# EAGLE design RWD 1Mb RAM Memory CPC v2_0 (EAGLE 8.6.0)
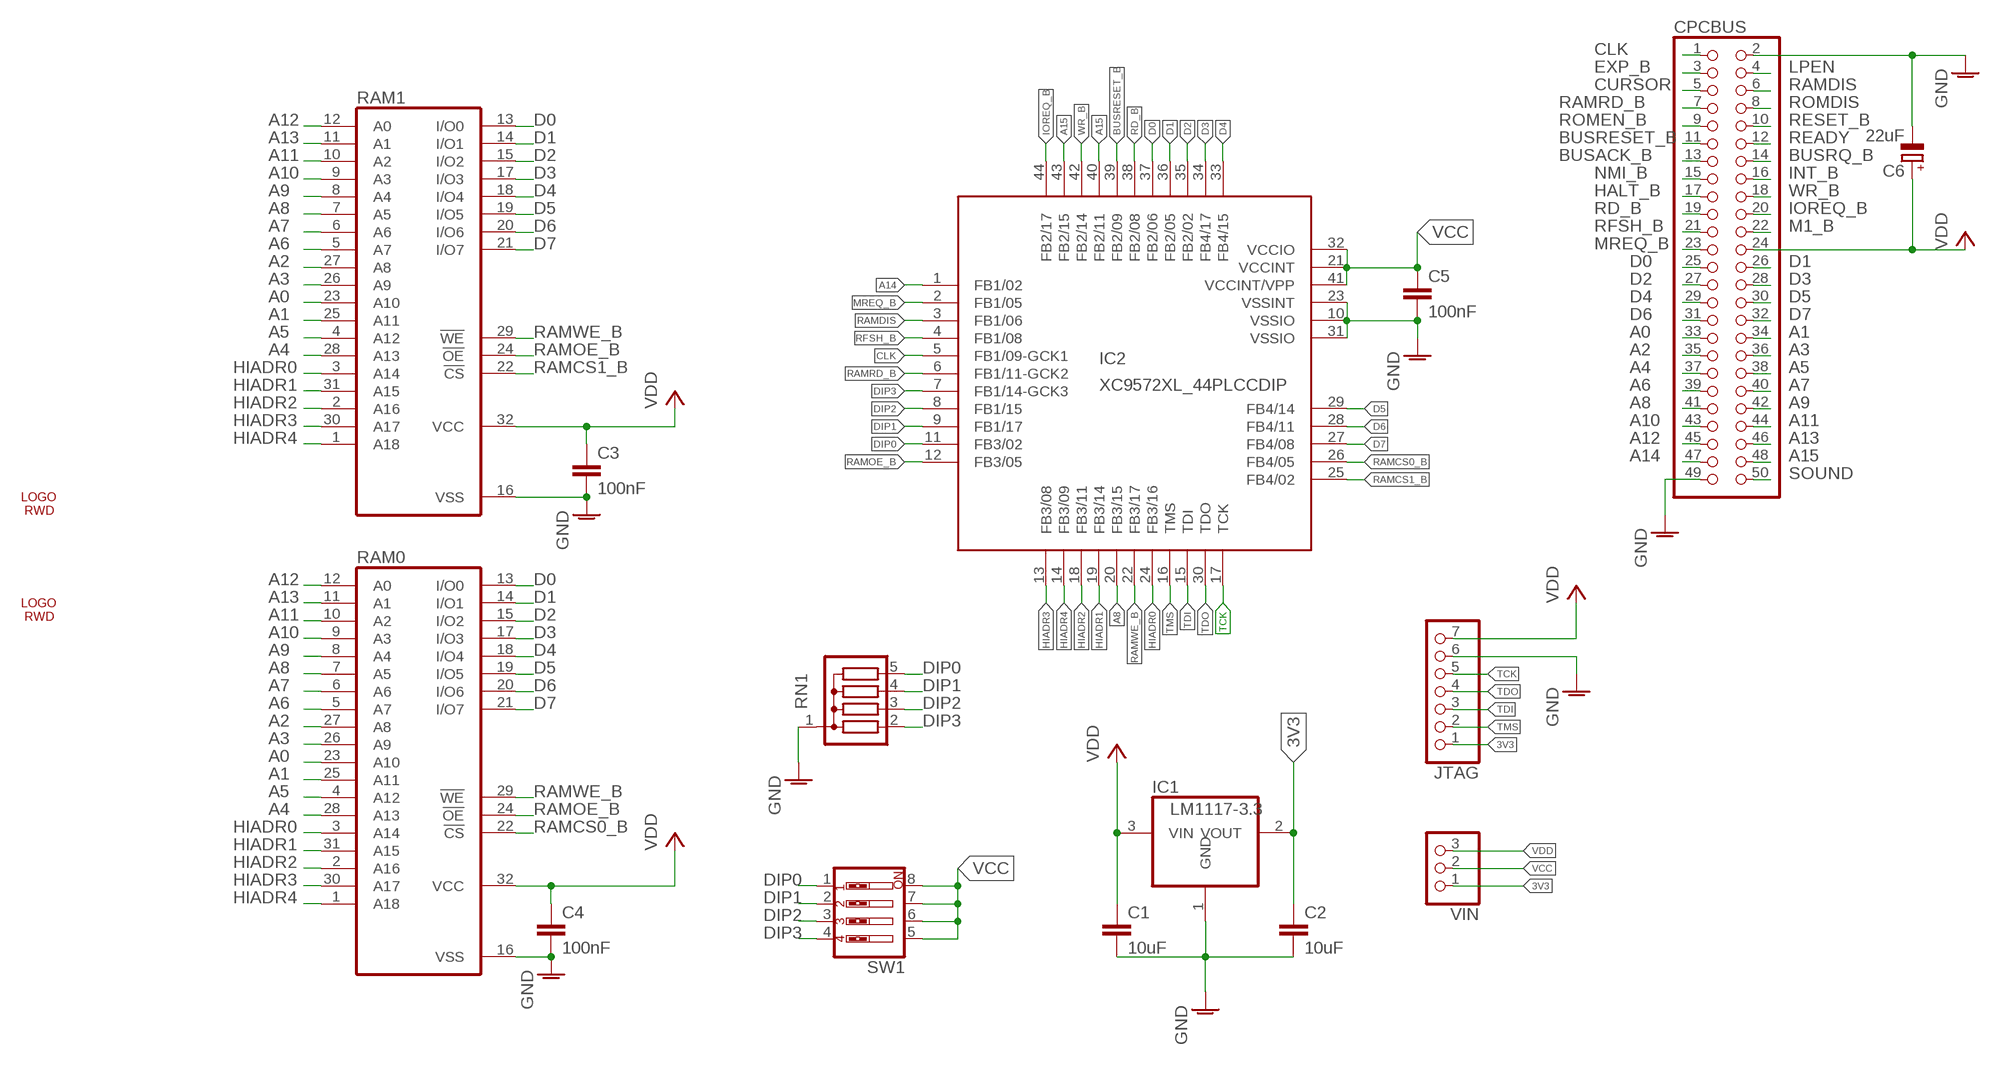
[diagram p0: schematic, sheet 1]

## Parts
C1  10uF  RCL_C-EUC0805  [RCL_C0805]
C2  10uF  RCL_C-EUC0805  [RCL_C0805]
C3  100nF  RCL_C-EUC0805  [RCL_C0805]
C4  100nF  RCL_C-EUC0805  [RCL_C0805]
C5  100nF  RCL_C-EUC0805  [RCL_C0805]
C6  22uF  CPOL-EUE2-5  [E2-5]
CPCBUS  PINHEAD_PINHD-2X25  [PINHEAD_2X25]
IC1  LM1117-3.3  BURR-BROWN_REG1117  [BURR-BROWN_SOT223]
IC2  XC9572XL_44PLCCDIP  [S44]
JTAG  PINHD-1X7  [1X07]
RAM0  MEMORY-HITACHI_628512  [MEMORY-HITACHI_DIL32]
RAM1  MEMORY-HITACHI_628512  [MEMORY-HITACHI_DIL32]
RN1  G04R  [SIL5]
SW1  SW_DIP-4  [EDG-04]
U$1  LOGO7TOP  [LOGO7_SK21]
U$2  LOGO7TOP  [LOGO7_SK21]
VIN  PINHD-1X3  [1X03]

## Nets
3V3: C2.1 IC1.2(VOUT) JTAG.1 VIN.1
A0: CPCBUS.33 RAM0.23(A10) RAM1.23(A10)
A1: CPCBUS.34 RAM0.25(A11) RAM1.25(A11)
A2: CPCBUS.35 RAM0.27(A8) RAM1.27(A8)
A3: CPCBUS.36 RAM0.26(A9) RAM1.26(A9)
A4: CPCBUS.37 RAM0.28(A13) RAM1.28(A13)
A5: CPCBUS.38 RAM0.4(A12) RAM1.4(A12)
A6: CPCBUS.39 RAM0.5(A7) RAM1.5(A7)
A7: CPCBUS.40 RAM0.6(A6) RAM1.6(A6)
A8: CPCBUS.41 IC2.20(FB3/15) RAM0.7(A5) RAM1.7(A5)
A9: CPCBUS.42 RAM0.8(A4) RAM1.8(A4)
A10: CPCBUS.43 RAM0.9(A3) RAM1.9(A3)
A11: CPCBUS.44 RAM0.10(A2) RAM1.10(A2)
A12: CPCBUS.45 RAM0.12(A0) RAM1.12(A0)
A13: CPCBUS.46 RAM0.11(A1) RAM1.11(A1)
A14: CPCBUS.47 IC2.1(FB1/02)
A15: CPCBUS.48 IC2.40(FB2/11) IC2.43(FB2/15)
AGND: C1.2 C2.2 C3.2 C4.2 C5.2 C6.- CPCBUS.2 CPCBUS.49 IC1.1(GND) IC2.10(VSSIO) IC2.23(VSSINT) IC2.31(VSSIO) JTAG.6 RAM0.16(VSS) RAM1.16(VSS) RN1.1 ; supply symbol labelled GND
BUSACK_B: CPCBUS.13
BUSRESET_B: CPCBUS.11 IC2.39(FB2/09)
BUSRQ_B: CPCBUS.14
CLK: CPCBUS.1 IC2.5(FB1/09-GCK1)
CURSOR: CPCBUS.5
D0: CPCBUS.25 IC2.37(FB2/06) RAM0.13(I/O0) RAM1.13(I/O0)
D1: CPCBUS.26 IC2.36(FB2/05) RAM0.14(I/O1) RAM1.14(I/O1)
D2: CPCBUS.27 IC2.35(FB2/02) RAM0.15(I/O2) RAM1.15(I/O2)
D3: CPCBUS.28 IC2.34(FB4/17) RAM0.17(I/O3) RAM1.17(I/O3)
D4: CPCBUS.29 IC2.33(FB4/15) RAM0.18(I/O4) RAM1.18(I/O4)
D5: CPCBUS.30 IC2.29(FB4/14) RAM0.19(I/O5) RAM1.19(I/O5)
D6: CPCBUS.31 IC2.28(FB4/11) RAM0.20(I/O6) RAM1.20(I/O6)
D7: CPCBUS.32 IC2.27(FB4/08) RAM0.21(I/O7) RAM1.21(I/O7)
DIP0: IC2.11(FB3/02) RN1.5 SW1.1
DIP1: IC2.9(FB1/17) RN1.4 SW1.2
DIP2: IC2.8(FB1/15) RN1.3 SW1.3
DIP3: IC2.7(FB1/14-GCK3) RN1.2 SW1.4
EXP_B: CPCBUS.3
HALT_B: CPCBUS.17
HIADR0: IC2.24(FB3/16) RAM0.3(A14) RAM1.3(A14)
HIADR1: IC2.19(FB3/14) RAM0.31(A15) RAM1.31(A15)
HIADR2: IC2.18(FB3/11) RAM0.2(A16) RAM1.2(A16)
HIADR3: IC2.13(FB3/08) RAM0.30(A17) RAM1.30(A17)
HIADR4: IC2.14(FB3/09) RAM0.1(A18) RAM1.1(A18)
INT_B: CPCBUS.16
IOREQ_B: CPCBUS.20 IC2.44(FB2/17)
LPEN: CPCBUS.4
M1_B: CPCBUS.22
MREQ_B: CPCBUS.23 IC2.2(FB1/05)
NMI_B: CPCBUS.15
RAMCS0_B: IC2.26(FB4/05) RAM0.22(!CS)
RAMCS1_B: IC2.25(FB4/02) RAM1.22(!CS)
RAMDIS: CPCBUS.6 IC2.3(FB1/06)
RAMOE_B: IC2.12(FB3/05) RAM0.24(!OE) RAM1.24(!OE)
RAMRD_B: CPCBUS.7 IC2.6(FB1/11-GCK2)
RAMWE_B: IC2.22(FB3/17) RAM0.29(!WE) RAM1.29(!WE)
RD_B: CPCBUS.19 IC2.38(FB2/08)
READY: CPCBUS.12
RESET_B: CPCBUS.10
RFSH_B: CPCBUS.21 IC2.4(FB1/08)
ROMDIS: CPCBUS.8
ROMEN_B: CPCBUS.9
SOUND: CPCBUS.50
TCK: IC2.17(TCK) JTAG.5
TDI: IC2.15(TDI) JTAG.3
TDO: IC2.30(TDO) JTAG.4
TMS: IC2.16(TMS) JTAG.2
VCC: C5.1 IC2.21(VCCINT) IC2.32(VCCIO) IC2.41(VCCINT/VPP) SW1.5 SW1.6 SW1.7 SW1.8 VIN.2
VDD: C1.1 C3.1 C4.1 C6.+ CPCBUS.24 IC1.3(VIN) JTAG.7 RAM0.32(VCC) RAM1.32(VCC) VIN.3
WR_B: CPCBUS.18 IC2.42(FB2/14)

## Library data of the parts
C1-C5 = Dandanator CPC MX4 v1.2 Rwd:RCL_C-EU: CAPACITOR, European symbol; SPICEPREFIX: C
C6 = rcl:CPOL-EU: POLARIZED CAPACITOR, European symbol; SPICEPREFIX: C
CPCBUS = Dandanator CPC MX4 v1.2 Rwd:PINHEAD_PINHD-2X25: PIN HEADER
IC1 = Dandanator CPC MX4 v1.2 Rwd:BURR-BROWN_REG1117: 800mA and 1A Low Dropout (LDO) Positive Regulator 1.8V, 2.5V, 2.85V, 3.3V, 5V, and Adj; MPN: REG1117; OC_FARNELL: 1097566; OC_NEWARK: 14P6981
IC2 = Dandanator CPC MX4 v1.2 Rwd:XC9572XL_44PLCC: xc9536_pc44 XC9500 In-System Programmable CPLD Family Auto generated by make-symbol-device-package-bsdl.ulp Rev. 34 Source: xc9536_pc44.bsd
JTAG = pinhead:PINHD-1X7: PIN HEADER
RAM0 RAM1 = RWD 1Mb RAM Memory CPC:MEMORY-HITACHI_628512: MEMORY; OC_FARNELL: unknown; OC_NEWARK: unknown
RN1 = resistor-sil:G04R: SIL RESISTOR; OC_FARNELL: unknown; OC_NEWARK: unknown
SW1 = special:SW_DIP-4: DIP SWITCH
U$1 U$2 = USB_Floppy_PCB_rwd:LOGO7
VIN = pinhead:PINHD-1X3: PIN HEADER

## Board
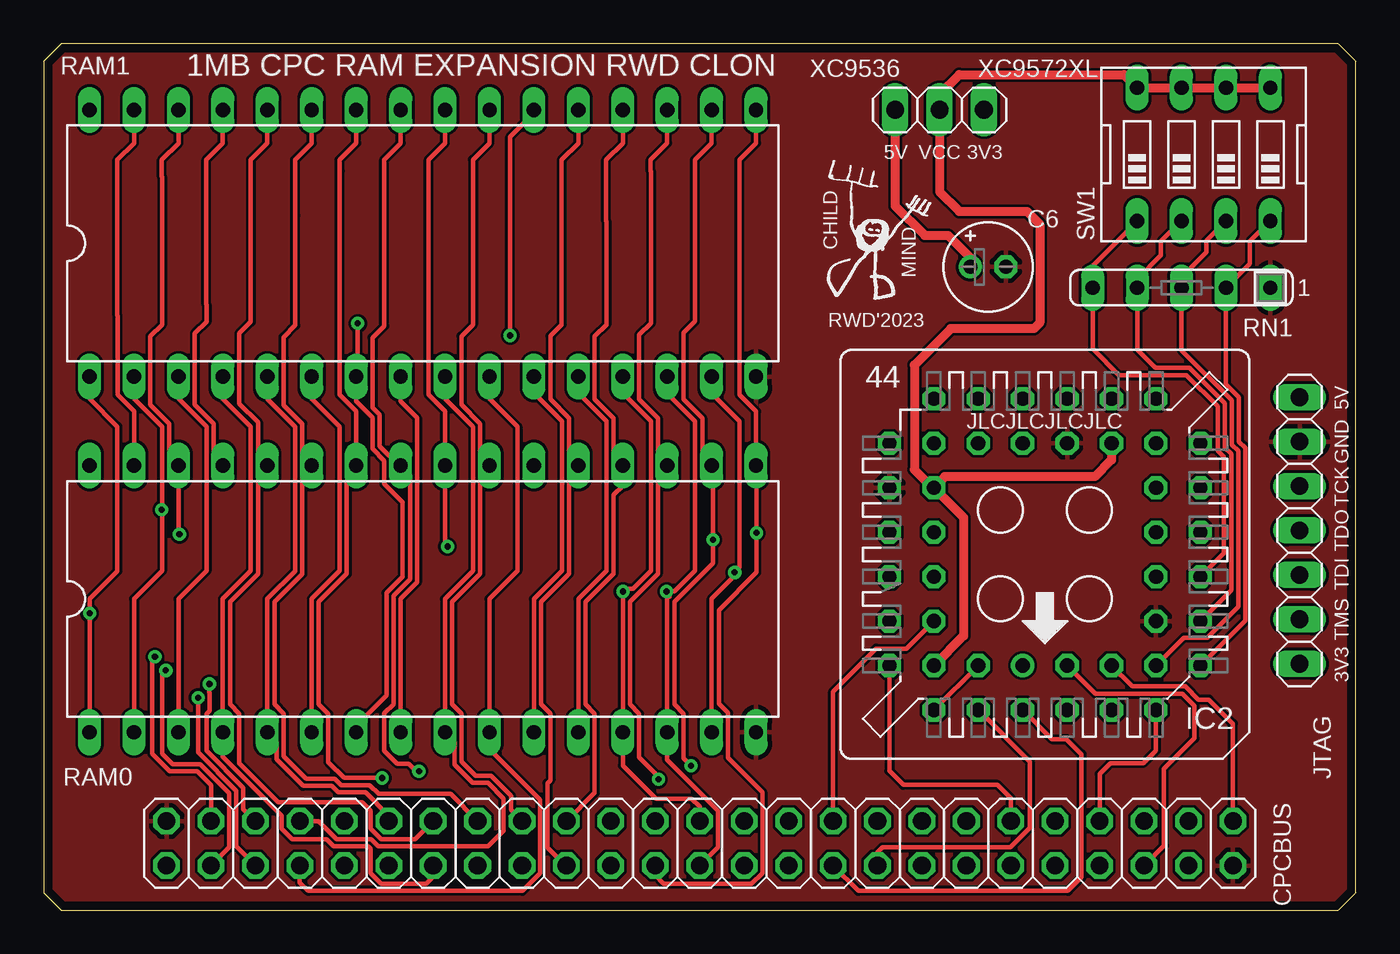
[diagram p1: board, top side]
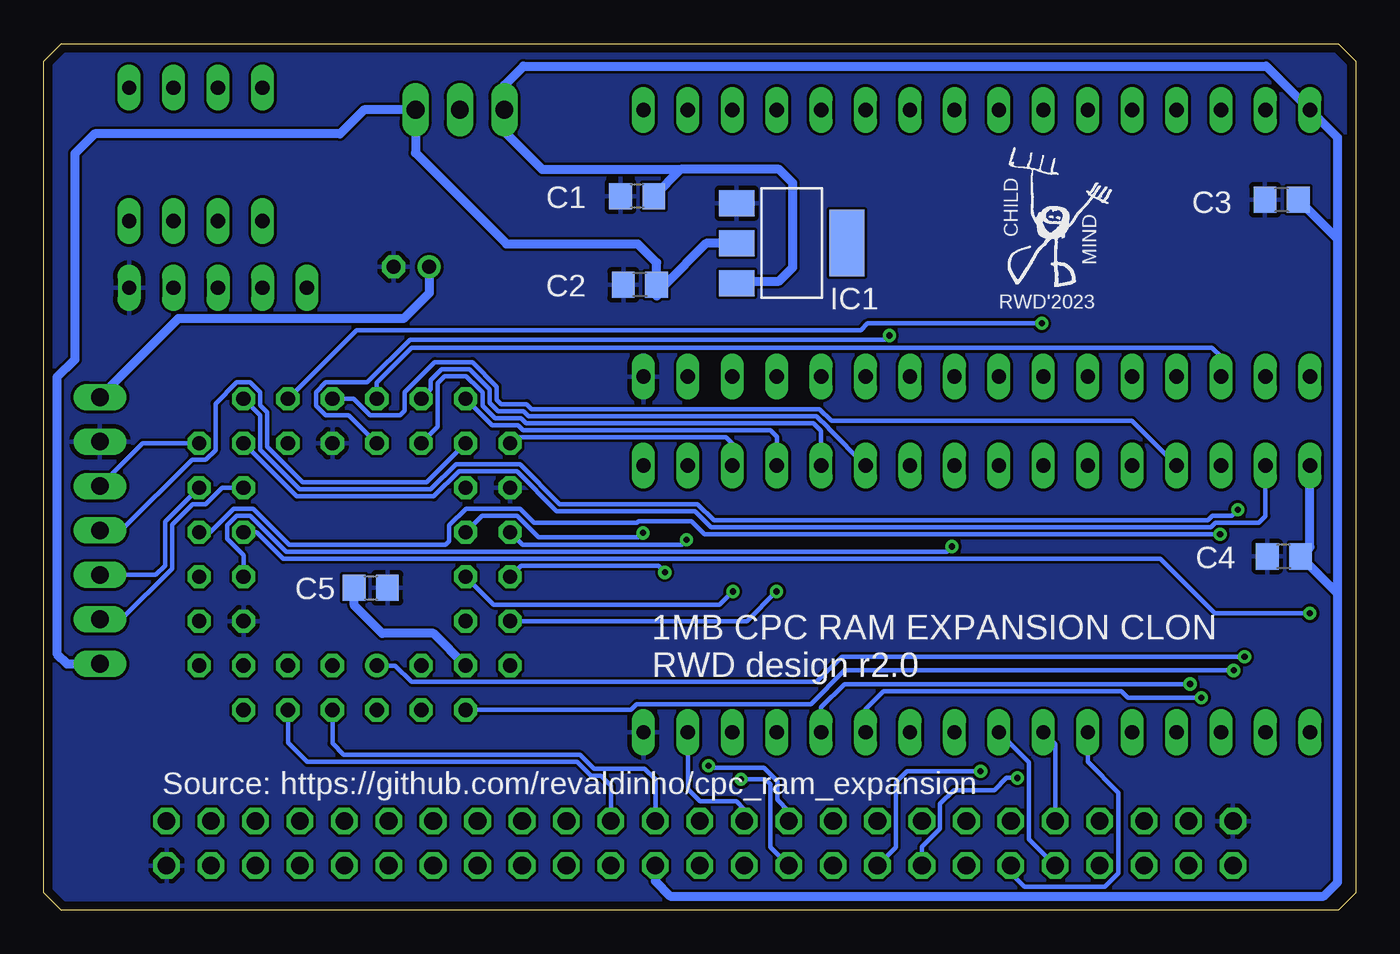
[diagram p2: board, bottom side, seen from below]

Size 75 x 49.5 mm. Coordinates in mm from the lower left corner, seen from the top.
Outline: 1,0 74,0 75,1 75,48.5 74,49.5 1,49.5 0,48.5 0,1 1,0
Copper layers (1*16): Top 0.035mm / dielectric 1.5mm / Bottom 0.035mm
Design rules "Rwd_2021": minimum track width 10mil, minimum drill 0.35mm, track to track 6mil, track to pad 6mil, pad to pad 6mil, via to via 6mil, smd to smd 6mil, copper to edge 0.5mm, drill to drill 8mil, minimum pad ring 10mil, minimum via ring 8mil, stop-mask expansion 4mil, vias tented up to drill 0mil, thermal gap 10mil

### Footprints (pad centres in the part's own frame; a part is rotated, then mirrored left to right if it is on the bottom)
RCL_C0805 = smd 1.3 x 1.5: 1 -0.95,0; 2 0.95,0
E2-5 = drill 0.813 pad 1.27: + -1.016,0 | drill 0.813 pad 1.27 octagon: - 1.016,0
PINHEAD_2X25 = drill 1.016 octagon: 1 -30.48,-1.27; 2 -30.48,1.27; 3 -27.94,-1.27; 4 -27.94,1.27; 5 -25.4,-1.27; 6 -25.4,1.27; 7 -22.86,-1.27; 8 -22.86,1.27; 9 -20.32,-1.27; 10 -20.32,1.27; 11 -17.78,-1.27; 12 -17.78,1.27; 13 -15.24,-1.27; 14 -15.24,1.27; 15 -12.7,-1.27; 16 -12.7,1.27; 17 -10.16,-1.27; 18 -10.16,1.27; 19 -7.62,-1.27; 20 -7.62,1.27; 21 -5.08,-1.27; 22 -5.08,1.27; 23 -2.54,-1.27; 24 -2.54,1.27; 25 0,-1.27; 26 0,1.27; 27 2.54,-1.27; 28 2.54,1.27; 29 5.08,-1.27; 30 5.08,1.27; 31 7.62,-1.27; 32 7.62,1.27; 33 10.16,-1.27; 34 10.16,1.27; 35 12.7,-1.27; 36 12.7,1.27; 37 15.24,-1.27; 38 15.24,1.27; 39 17.78,-1.27; 40 17.78,1.27; 41 20.32,-1.27; 42 20.32,1.27; 43 22.86,-1.27; 44 22.86,1.27; 45 25.4,-1.27; 46 25.4,1.27; 47 27.94,-1.27; 48 27.94,1.27; 49 30.48,-1.27; 50 30.48,1.27
BURR-BROWN_SOT223 = smd 1.499 x 2.007: 1 -2.261,-3.15; 2 0.025,-3.15; 3 2.311,-3.15 | smd 3.81 x 2.007: 4 0,3.15
S44 = drill 0.813: 1 1.27,6.35 | drill 0.813 octagon: 2 -1.27,8.89; 3 -1.27,6.35; 4 -3.81,8.89; 5 -3.81,6.35; 6 -6.35,8.89; 7 -8.89,6.35; 8 -6.35,6.35; 9 -8.89,3.81; 10 -6.35,3.81; 11 -8.89,1.27; 12 -6.35,1.27; 13 -8.89,-1.27; 14 -6.35,-1.27; 15 -8.89,-3.81; 16 -6.35,-3.81; 17 -8.89,-6.35; 18 -6.35,-8.89; 19 -6.35,-6.35; 20 -3.81,-8.89; 21 -3.81,-6.35; 22 -1.27,-8.89; 23 -1.27,-6.35; 24 1.27,-8.89; 25 1.27,-6.35; 26 3.81,-8.89; 27 3.81,-6.35; 28 6.35,-8.89; 29 8.89,-6.35; 30 6.35,-6.35; 31 8.89,-3.81; 32 6.35,-3.81; 33 8.89,-1.27; 34 6.35,-1.27; 35 8.89,1.27; 36 6.35,1.27; 37 8.89,3.81; 38 6.35,3.81; 39 8.89,6.35; 40 6.35,8.89; 41 6.35,6.35; 42 3.81,8.89; 43 3.81,6.35; 44 1.27,8.89
1X07 = drill 1.016 long: 1 -7.62,0; 2 -5.08,0; 3 -2.54,0; 4 0,0; 5 2.54,0; 6 5.08,0; 7 7.62,0
MEMORY-HITACHI_DIL32 = drill 0.813 long: 1 -19.05,-7.62; 2 -16.51,-7.62; 3 -13.97,-7.62; 4 -11.43,-7.62; 5 -8.89,-7.62; 6 -6.35,-7.62; 7 -3.81,-7.62; 8 -1.27,-7.62; 9 1.27,-7.62; 10 3.81,-7.62; 11 6.35,-7.62; 12 8.89,-7.62; 13 11.43,-7.62; 14 13.97,-7.62; 15 16.51,-7.62; 16 19.05,-7.62; 17 19.05,7.62; 18 16.51,7.62; 19 13.97,7.62; 20 11.43,7.62; 21 8.89,7.62; 22 6.35,7.62; 23 3.81,7.62; 24 1.27,7.62; 25 -1.27,7.62; 26 -3.81,7.62; 27 -6.35,7.62; 28 -8.89,7.62; 29 -11.43,7.62; 30 -13.97,7.62; 31 -16.51,7.62; 32 -19.05,7.62
SIL5 = drill 0.813 long: 1 -5.08,0; 2 -2.54,0; 3 0,0; 4 2.54,0; 5 5.08,0
EDG-04 = drill 0.813 long: 1 -3.81,-3.81; 2 -1.27,-3.81; 3 1.27,-3.81; 4 3.81,-3.81; 5 3.81,3.81; 6 1.27,3.81; 7 -1.27,3.81; 8 -3.81,3.81
1X03 = drill 1.016 long: 1 -2.54,0; 2 0,0; 3 2.54,0

### Placement (x,y rotation side)
C1  41.08,40.79 180 bottom
C2  40.92,35.73 180 bottom
C3  4.24,40.58 180 bottom
C4  4.11,20.2 180 bottom
C5  56.3,18.41 0 bottom
C6  53.99,36.75 0 top
CPCBUS  37.5,3.81 180 top
IC1  32.24,38.12 270 bottom
IC2  57.23,20.32 180 top
JTAG  71.79,21.69 90 top
RAM0  21.67,17.78 0 top
RAM1  21.67,38.1 0 top
RN1  65.04,35.56 180 top
SW1  66.31,43.18 0 top
U$1  20.4,35.32 0 bottom
U$2  44.27,34.6 0 top
VIN  51.21,45.73 180 top

### Tracks (layer width: path | path; a pad name or v marks a point on that pad's centre or on a via)
3V3
  Bottom 0.508: IC1.2 37.14,38.09 39.5,35.73 C2.1 | C2.1 39.97,35.07 | JTAG.1 73.66,14.07 74.25,14.65 74.25,30.43 73.23,31.45 73.23,43.23 72.1,44.35 58.06,44.35 56.69,45.73 VIN.1 | C2.1 39.97,36.99 41.05,38.06 48.55,38.06 53.75,43.27 VIN.1 | VIN.1 53.63,45.6
A0
  Top 0.254: RAM1.23 25.48,43.81 24.54,42.88 24.54,33.45 23.88,32.79 23.88,28.86 24.95,27.79 24.95,26.99 24.95,25.97 25.48,25.44 RAM0.23 24.97,24.89 24.95,24.89 24.95,19.21 23.35,17.61 23.35,11.74 23.88,11.21 23.88,8.47 24.68,7.67 25.57,7.67 26.7,6.53 26.7,5.71 CPCBUS.33
A1  (via drill 0.35)
  Top 0.254: RAM1.25 20.4,43.81 19.46,42.88 19.46,33.37 18.8,32.71 18.8,28.7 19.21,28.29 19.21,26.51 20.36,25.36 RAM0.25 20.93,24.87 20.93,18.89 19.99,17.95 19.99,11.77 19.46,11.24 19.46,9.11 20.21,8.36 20.86,8.36 21.29,7.93 v21.45,7.93
  Bottom 0.254: v21.45,7.93 25.64,7.93 26.29,7.29 26.29,3.59 CPCBUS.34
A2
  Top 0.254: RAM1.27 15.32,43.81 14.37,42.86 14.37,39.69 14.38,39.67 14.38,33.41 13.71,32.74 13.71,31.54 13.72,31.53 13.72,28.84 14.77,27.79 14.77,25.95 RAM0.27 14.77,24.85 14.77,19.2 13.19,17.61 13.19,11.74 13.72,11.21 13.72,8.78 15,7.5 16.64,7.5 17,7.14 | 17,7.14 | 17,7.14 18.63,7.14 19.13,6.63 23.25,6.63 CPCBUS.35
A3  (via drill 0.35)
  Top 0.254: RAM1.26 17.86,43.81 16.91,42.86 16.91,42.23 16.92,42.22 16.92,29.43 17.86,28.49 RAM0.26 17.86,25.04 17.33,24.5 17.33,19.21 15.73,17.61 15.73,11.74 16.26,11.21 16.26,8.46 17.17,7.54 v19.35,7.54
  Bottom 0.254: v19.35,7.54 19.97,7.54 20.66,6.86 22.98,6.86 23.76,6.08 23.76,4.65 24.8,3.61 CPCBUS.36
A4
  Top 0.254: RAM1.28 12.78,43.81 11.84,42.88 11.84,33.6 11.18,32.94 11.18,28.94 12.25,27.87 12.25,26.12 12.78,25.59 RAM0.28 12.25,24.87 12.25,19.21 10.65,17.61 10.65,11.74 11.18,11.21 11.18,8.38 13.41,6.15 14.6,6.15 14.89,6.15 18.2,6.15 18.68,5.68 18.68,4.65 19.29,4.04 21.22,4.04 CPCBUS.37
A5
  Top 0.254: RAM1.4 10.24,29.22 11.84,27.62 11.84,19.38 10.24,17.78 RAM0.4 10.24,8.74 13.6,5.39 13.6,4.65 14.21,4.04 16.17,4.04 16.58,3.63 18.55,3.63 18.68,3.5 18.68,2.11 19.29,1.5 21.86,1.5 22.26,1.9 CPCBUS.38
A6
  Top 0.254: RAM1.5 12.78,29.21 14.37,27.62 14.37,19.37 12.78,17.78 RAM0.5 13.31,9.63 13.31,8.61 14.03,7.9 14.83,7.1 16.47,7.1 16.83,6.73 18.39,6.73 19.72,5.4 CPCBUS.39
A7
  Top 0.254: RAM0.6 15.32,17.78 16.92,19.38 16.92,27.62 15.32,29.22 RAM1.6
  Bottom 0.254: RAM0.6 15.32,8.46 13.56,6.7 13.56,2.11 14.34,1.33 18.95,1.33 19.72,2.1 CPCBUS.40
A8  (via drill 0.35)
  Top 0.254: v17.95,33.53 17.95,30.57 RAM1.7 17.86,29.07 18.8,28.12 18.8,26.34 19.46,25.68 19.46,24.35 20.51,23.3 20.51,19.04 19.59,18.12 19.59,12.26 17.86,10.53 RAM0.7
  Bottom 0.254: IC2.20 57.11,33.14 28.29,33.14 27.9,33.53 v17.95,33.53 | RAM0.7 17.18,9.48 CPCBUS.41
A9
  Top 0.254: RAM0.8 20.4,17.78 21.34,18.72 21.34,28.12 20.4,29.07 RAM1.8
  Bottom 0.254: RAM0.8 18.69,8.45 18.69,5.52 18.68,5.51 18.68,4.04 CPCBUS.42
A10
  Top 0.254: RAM1.9 22.94,29.22 24.54,27.62 24.54,19.38 22.94,17.78 RAM0.9 23.47,9.63 23.47,8.71 | 23.47,8.71 | 23.47,8.71 23.47,8.3 24.51,7.26 25.4,7.26 26.3,6.36 26.3,4.53 25.4,3.63 19.12,3.63 18.71,4.04 16.75,4.04 15.71,5.08 CPCBUS.43
A11
  Top 0.254: RAM1.10 25.48,29.22 27.08,27.62 27.08,19.38 25.48,17.78 RAM0.10 25.48,9.2 28.38,6.3 28.38,2.11 27.36,1.09 15.12,1.09 14.64,1.57 CPCBUS.44
A12  (via drill 0.35)
  Top 0.254: RAM0.12 30.56,17.78 32.16,19.38 32.16,27.94 30.56,29.54 RAM1.12 | v9.47,12.91 9.47,12.42 9.48,12.41 9.48,11.39 9.3,11.21 9.3,9.11 11.41,7 11.41,5.77 CPCBUS.45
  Bottom 0.254: v9.47,12.91 29.23,12.91 30.56,11.58 RAM0.12
A13  (via drill 0.35)
  Top 0.254: RAM0.11 28.02,17.78 29.62,19.38 29.62,27.94 28.02,29.54 RAM1.11 | v8.82,12.13 8.82,9.01 11.01,6.83 11.01,3.63 CPCBUS.46
  Bottom 0.254: RAM0.11 28.02,11.47 26.99,12.51 13.39,12.51 13.02,12.13 v8.82,12.13
A14  (via drill 0.35)
  Top 0.254: v6.36,14.47 6.2,14.31 6.2,8.91 7.19,7.92 8.76,7.92 9.56,7.13 CPCBUS.47
  Bottom 0.254: IC2.1 54.91,13.97 53.97,13.03 30.82,13.03 29.38,14.47 v6.36,14.47
A15  (via drill 0.35)
  Top 0.254: IC2.40 IC2.43 | v6.98,13.69 6.76,13.47 6.76,8.93 7.36,8.33 8.93,8.33 10.6,6.66 10.6,3.58 CPCBUS.48
  Bottom 0.254: IC2.40 41.44,11.43 41.11,11.76 31.16,11.76 29.23,13.69 v6.98,13.69
AGND
  pour Bottom: 0.13,49.4 74.83,49.4 74.83,0.16 0.13,0.16
  pour Top: 0.13,49.4 74.83,49.4 74.83,0.16 0.13,0.16
BUSRESET_B
  Top 0.254: IC2.39 48.34,7.96 49.14,7.16 54.52,7.16 55.28,6.39 CPCBUS.11
CLK
  Top 0.254: IC2.5 62.23,12.78 65.25,12.78 66.01,12.02 66.61,12.02 67.98,10.65 CPCBUS.1
D0  (via drill 0.35)
  Top 0.254: RAM1.13 33.1,29.54 34.7,27.94 34.7,19.38 33.68,18.36 33.27,18.36 v33.12,18.2 33.1,18.19 RAM0.13 33.1,8.26 35,6.36 37.03,6.36 37.5,5.89 CPCBUS.25
  Bottom 0.254: IC2.37 34.81,16.51 v33.12,18.2
D1  (via drill 0.35)
  Top 0.254: RAM1.14 35.64,29.54 37.24,27.94 37.24,19.38 36.06,18.2 35.76,18.2 | v35.6,18.2 35.76,18.2 | 35.76,18.2 35.76,17.9 35.64,17.78 RAM0.14 35.64,8.57 38.54,5.67 38.54,3.58 CPCBUS.26
  Bottom 0.254: IC2.36 49.28,17.45 36.36,17.45 v35.6,18.2
D2  (via drill 0.35)
  Top 0.254: RAM0.15 38.18,17.78 39.49,19.09 v39.49,19.29 39.78,19.58 39.78,27.94 38.18,29.54 RAM1.15
  Bottom 0.254: v39.49,19.29 39.87,19.66 47.73,19.66 IC2.35 | CPCBUS.27 34.96,5.77 35.4,6.21 37.5,6.21 38.18,6.89 RAM0.15
D3  (via drill 0.35)
  Top 0.254: RAM1.17 40.72,43.81 39.77,42.86 39.77,31.11 39.78,31.1 39.78,29.43 40.72,28.49 RAM0.17 40.74,25.38 v40.74,21.55 40.74,19.29 38.59,17.14 38.59,11.8 39.12,11.27 39.12,8.7 41.08,6.74 41.08,2.11 40.47,1.5 35.44,1.5 34.96,1.98 CPCBUS.28
  Bottom 0.254: IC2.34 49.94,22.53 47.95,22.53 46.71,21.29 41,21.29 v40.74,21.55
D4  (via drill 0.35)
  Top 0.254: RAM1.18 38.18,43.81 37.23,42.86 37.23,33.63 36.58,32.98 36.58,29.18 37.65,28.11 37.65,25.93 RAM0.18 38.25,25.33 v38.25,21.16 38.25,19.82 36.05,17.61 36.05,11.74 36.58,11.21 36.58,8.67 v37.01,8.24
  Bottom 0.254: IC2.33 47.63,20.88 38.53,20.88 v38.25,21.16 | v37.01,8.24 36.88,8.12 33.84,8.12 33.06,7.35 33.06,6.29 32.42,5.65 CPCBUS.29
D5  (via drill 0.35)
  Top 0.254: RAM1.19 35.64,43.81 34.69,42.86 34.69,42.23 34.7,42.22 34.7,33.53 34.04,32.87 34.04,29.18 35.11,28.11 35.11,25.97 35.64,25.44 RAM0.19 35.11,24.87 35.11,19.21 33.51,17.61 33.51,11.74 34.04,11.21 34.04,8.72 35.14,7.62 v35.14,7.47
  Bottom 0.254: RAM0.19 35.64,26.64 36,27 48.01,27 IC2.29 | CPCBUS.30 33.47,3.59 33.47,7.18 33.76,7.47 v35.14,7.47
D6
  Top 0.254: RAM1.20 33.1,43.81 32.15,42.86 32.15,39.37 32.16,39.36 32.16,33.45 31.5,32.79 31.5,29.18 32.57,28.11 32.57,26.12 33.1,25.59 RAM0.20 33.1,24.25 32.57,23.72 32.57,19.21 30.97,17.61 30.97,11.74 31.5,11.21 31.5,6.7 CPCBUS.31
  Bottom 0.254: RAM0.20 33.1,27.05 33.45,27.41 47.61,27.41 47.9,27.69 49.36,27.69 IC2.28
D7
  Top 0.254: RAM1.21 30.56,43.81 29.61,42.86 29.61,33.45 28.96,32.8 28.96,29.18 30.03,28.11 30.03,26.12 30.56,25.59 RAM0.21 30.03,24.87 30.03,19.21 28.43,17.61 28.43,11.74 28.96,11.21 28.96,7.43 28.79,7.26 28.79,3.55 29.8,2.54 CPCBUS.32
  Bottom 0.254: IC2.27 52.48,27.61 52.48,30.11 52.1,30.49 50.85,30.49 50.51,30.15 50.49,30.15 49.92,29.58 49.92,28.82 49.19,28.1 47.73,28.1 47.44,27.81 30.99,27.81 30.56,27.38 RAM0.21
DIP0
  Top 0.254: IC2.11 67.47,20.4 67.47,25.9 67.11,26.26 67.11,28.78 65.32,30.57 61.45,30.57 59.96,32.06 RN1.5 59.96,36.81 62.5,39.35 SW1.1
DIP1
  Top 0.254: IC2.9 67.87,18.26 67.87,26.07 67.52,26.42 67.52,28.95 65.49,30.98 63.55,30.98 62.5,32.02 RN1.4 62.5,36.05 63.87,37.42 63.87,38.2 SW1.2
DIP2
  Top 0.254: IC2.8 65.18,15.57 66.51,15.57 68.28,17.34 68.28,26.23 67.92,26.59 67.92,29.12 65.04,32 RN1.3 65.04,36.17 66.45,37.58 66.45,38.24 SW1.3
DIP3
  Top 0.254: IC2.7 68.69,16.54 68.69,26.4 68.33,26.76 68.33,29.29 67.58,30.04 RN1.2 68.95,36.93 68.95,38.2 SW1.4
HIADR0
  Top 0.254: RAM0.3 7.7,17.78 9.3,19.38 9.3,27.62 7.7,29.22 RAM1.3
  Bottom 0.254: IC2.24 55.96,30.13 53.96,32.13 8.22,32.13 7.7,31.6 RAM1.3
HIADR1
  Top 0.254: RAM0.31 5.16,28.49 4.22,29.43 4.22,33.96 4.21,33.97 4.21,42.86 5.16,43.81 RAM1.31
  Bottom 0.254: RAM0.31 5.16,22.51 5.54,22.13 8.03,22.13 8.28,21.88 36.87,21.88 37.78,22.79 45.67,22.79 47.95,25.07 51.27,25.07 52.71,23.63 60.54,23.63 IC2.19
HIADR2  (via drill 0.35)
  Top 0.254: RAM0.2 5.16,17.78 6.76,19.38 6.76,22.86 v6.75,22.87 6.76,22.88 6.76,27.62 5.16,29.22 RAM1.2
  Bottom 0.254: IC2.18 62.64,28.27 62.64,27.1 62.64,26.3 | 62.64,26.3 | v6.75,22.87 7.08,22.53 8.2,22.53 8.45,22.28 36.7,22.28 37.62,23.2 45.5,23.2 47.78,25.48 51.44,25.48 52.88,24.04 60.37,24.04 62.64,26.3 | 61.56,25.22 62.64,26.3
HIADR3  (via drill 0.35)
  Top 0.254: RAM1.30 7.7,43.81 6.75,42.86 6.75,41.91 6.76,41.9 6.76,33.45 6.1,32.79 6.1,28.86 7.17,27.79 7.17,26.28 7.7,25.75 RAM0.30 7.7,21.53 v7.76,21.47
  Bottom 0.254: IC2.13 65.48,21.59 64.14,22.94 63.02,22.94 60.97,20.88 52.02,20.88 51.82,21.08 51.82,21.98 50.86,22.94 47.78,22.94 46.98,22.13 41.09,22.13 41.01,22.2 37.97,22.2 37.24,21.47 v7.76,21.47
HIADR4  (via drill 0.35)
  Top 0.254: RAM1.1 2.62,29.21 4.21,27.62 4.21,19.37 2.62,17.78 v2.62,16.96 v2.62,16.95 RAM0.1
  Bottom 0.254: v2.62,16.96 8.07,16.96 11.18,20.07 61.31,20.07 62.83,21.59 IC2.14
IOREQ_B
  Top 0.254: IC2.44 57.63,9.76 58.15,9.76 58.47,9.76 59.32,8.91 59.32,1.86 58.55,1.09 46.57,1.09 CPCBUS.20
MREQ_B
  Bottom 0.254: IC2.2 58.5,9.52 57.85,8.87 44.35,8.87 43.55,8.06 40.65,8.06 40.04,7.46 CPCBUS.23
RAMCS0_B
  Bottom 0.254: IC2.26 52.89,29.74 52.89,30.28 52.26,30.9 50.66,30.9 49.51,29.75 49.51,28.99 49.03,28.5 47.56,28.5 47.27,28.22 30.82,28.22 30.15,27.55 30.15,27.53 RAM0.22
RAMCS1_B  (via drill 0.35)
  Top 0.254: v26.66,32.83 26.66,44.18 28.02,45.54 RAM1.22
  Bottom 0.254: v26.66,32.83 26.89,32.59 54.07,32.59 56.51,30.15 58.89,30.15 59.44,29.6 59.44,28.82 58.89,28.27 57.56,28.27 IC2.25
RAMDIS
  Top 0.254: IC2.3 60.1,12.37 65.08,12.37 65.78,11.67 65.78,9.81 64.03,8.06 64.03,3.67 CPCBUS.6
RAMOE_B  (via drill 0.35)
  Top 0.254: RAM1.24 22.94,43.81 22,42.88 22,29.43 22.94,28.49 RAM0.24 22.94,20.91 v23.08,20.77
  Bottom 0.254: IC2.12 63.58,20.26 64.52,21.2 64.52,21.98 63.97,22.53 63.19,22.53 61.14,20.48 23.38,20.48 v23.08,20.77
RAMRD_B
  Top 0.254: IC2.6 63.58,9.11 62.85,8.39 60.97,8.39 60.36,7.78 CPCBUS.7
RAMWE_B
  Top 0.254: RAM1.29 10.24,43.81 9.29,42.86 9.29,34.61 9.3,34.59 9.3,33.6 8.64,32.94 8.64,28.86 9.71,27.79 9.71,25.93 RAM0.29
  Bottom 0.254: IC2.22 57.29,29.21 56.35,28.27 54.63,28.27 54.36,28.54 54.36,29.6 52.65,31.3 50.5,31.3 49.1,29.91 49.1,29.16 48.86,28.91 47.39,28.91 47.1,28.63 30.66,28.63 29.98,27.95 12.79,27.95 RAM0.29
RD_B
  Top 0.254: IC2.38 49.3,14.94 47.58,14.94 45.12,12.47 CPCBUS.19
RFSH_B
  Bottom 0.254: IC2.4 61.04,9.57 59.94,8.46 44.52,8.46 43.72,7.66 43.15,7.66 42.58,7.09 42.58,6.37 CPCBUS.21
TCK
  Bottom 0.254: JTAG.5 69.34,26.67 IC2.17
TDI
  Bottom 0.254: JTAG.3 68.59,19.15 68.06,19.68 68.06,22.19 IC2.15
TDO
  Bottom 0.254: IC2.30 53.11,24.44 60.2,24.44 62.23,26.47 62.23,28.44 62.64,28.84 62.64,29.6 63.19,30.15 63.97,30.15 65.18,28.94 65.18,26.28 65.73,25.73 66.53,25.73 70.57,21.69 JTAG.4
TMS
  Bottom 0.254: JTAG.2 70.56,16.61 67.66,19.51 67.66,22.02 66.48,23.19 65.73,23.19 64.79,24.13 IC2.16
VCC
  Top 0.508: IC2.32 52.58,22.43 52.58,15.67 IC2.41 | IC2.32 51.51,24.76 60.08,24.76 61.04,25.72 IC2.21 | IC2.32 50.79,24.13 49.76,25.16 49.76,31.13 51.85,33.23 56.61,33.23 56.94,33.55 56.94,39.19 56.21,39.92 52.34,39.92 51.21,41.05 VIN.2 51.21,46.61 52.34,47.74 61.75,47.74 SW1.8 SW1.7 SW1.6 SW1.5
  Bottom 0.508: C5.1 57.25,17.41 55.65,15.81 52.72,15.81 IC2.41
VDD
  Top 0.508: VIN.3 48.67,40.24 50.36,38.55 51.69,38.55 52.97,37.27 C6.+
  Bottom 0.254: 1.03,38.33 1.03,37.8
  Bottom 0.508: IC1.3 35.26,35.94 32.96,35.94 32.18,36.72 32.18,41.54 32.96,42.32 38.6,42.32 | 38.6,42.32 C1.1 | 1.03,18.08 1.03,1.59 1.83,0.8 39.19,0.8 40.04,1.64 CPCBUS.24 | 1.03,18.08 1.03,37.8 1.03,44.13 RAM1.32 5.13,48.23 47.58,48.23 48.67,47.14 VIN.3 48.67,44.48 46.51,42.32 38.6,42.32 | C3.1 1.03,38.33 | JTAG.7 67.31,33.79 54.44,33.79 52.97,35.26 C6.+ | 1.03,18.08 C4.1 2.62,20.74 RAM0.32
WR_B
  Top 0.254: IC2.42 56.37,8.48 56.37,4.7 55.25,3.58 47.94,3.58 47.66,3.31 CPCBUS.18

### Text on the board
tPlace: 1MB CPC RAM EXPANSION RWD CLON | RWD'2023 | JLCJLCJLCJLC
bPlace: RWD'2023 | 1MB CPC RAM EXPANSION CLON / RWD design r2.0 | Source: https://github.com/revaldinho/cpc_ram_expansion
tNames: XC9536 | XC9572XL | 5V | VCC | 3V3 | 5V | GND | TCK | TDO | TDI | TMS | 3V3